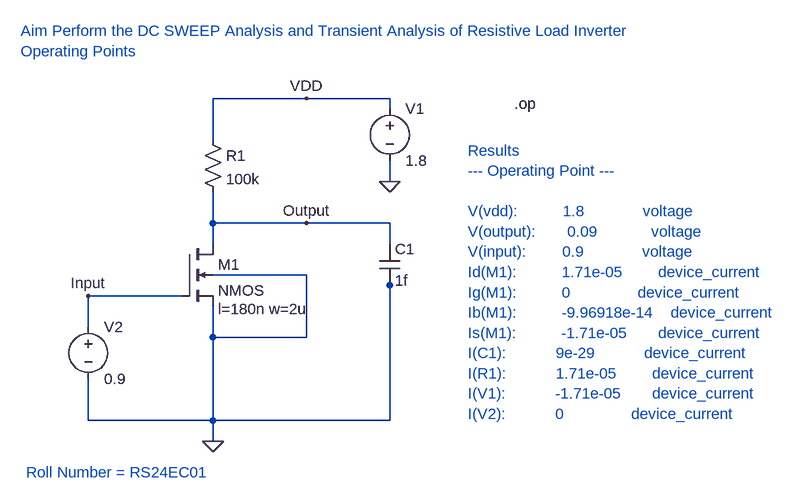
[diagram p0: schematic Exp1 VTC_Resistive_Inverter_Operating_Point.asc]
Exp1 VTC_Resistive_Inverter_Operating_Point.asc, the LTspice schematic file:
Version 4
SHEET 1 1576 680
WIRE 448 -112 304 -112
WIRE 576 -112 448 -112
WIRE 576 -96 576 -112
WIRE 304 -48 304 -112
WIRE 576 16 576 -16
WIRE 304 80 304 32
WIRE 448 80 304 80
WIRE 576 80 448 80
WIRE 304 112 304 80
WIRE 576 112 576 80
WIRE 448 160 304 160
WIRE 576 176 576 160
WIRE 256 192 112 192
WIRE 112 240 112 192
WIRE 304 256 304 208
WIRE 448 256 448 160
WIRE 448 256 304 256
WIRE 112 384 112 320
WIRE 304 384 304 256
WIRE 304 384 112 384
WIRE 576 384 576 176
WIRE 576 384 304 384
WIRE 304 416 304 384
FLAG 576 16 0
FLAG 304 416 0
FLAG 112 192 Input
FLAG 448 80 Output
FLAG 448 -112 VDD
SYMBOL res 288 -64 R0
SYMATTR InstName R1
SYMATTR Value 100k
SYMBOL cap 560 112 R0
SYMATTR InstName C1
SYMATTR Value 1f
SYMBOL voltage 576 -112 R0
WINDOW 123 0 0 Left 0
WINDOW 39 0 0 Left 0
SYMATTR InstName V1
SYMATTR Value 1.8
SYMBOL voltage 112 224 R0
WINDOW 123 0 0 Left 0
WINDOW 39 0 0 Left 0
SYMATTR InstName V2
SYMATTR Value 0.9
SYMBOL nmos4 256 112 R0
WINDOW 123 56 100 Left 2
SYMATTR Value2 l=180n w=2u
SYMATTR InstName M1
TEXT 8 -216 Left 2 ;Aim Perform the DC SWEEP Analysis and Transient Analysis of Resistive Load Inverter\nOperating Points
TEXT 16 464 Left 2 ;Roll Number = RS24EC01
TEXT 768 -104 Left 2 !.op
TEXT 696 -32 Left 2 ;Results \n--- Operating Point ---\n \nV(vdd):          1.8             voltage\nV(output):       0.09            voltage\nV(input):        0.9             voltage\nId(M1):          1.71e-05        device_current\nIg(M1):          0               device_current\nIb(M1):          -9.96918e-14    device_current\nIs(M1):          -1.71e-05       device_current\nI(C1):           9e-29           device_current\nI(R1):           1.71e-05        device_current\nI(V1):           -1.71e-05       device_current\nI(V2):           0               device_current

The netlist it stands for:
* Exp1 VTC_Resistive_Inverter_Operating_Point.asc
R1 VDD Output 100k
C1 Output 0 1f
V1 VDD 0 1.8
V2 Input 0 0.9
M1 Output Input 0 0 NMOS l=180n w=2u
.model NMOS NMOS
.model PMOS PMOS
.lib standard.mos
* Aim Perform the DC SWEEP Analysis and Transient Analysis of Resistive Load Inverter
* Operating Points
* Roll Number = RS24EC01
.op
* Results
* --- Operating Point ---
* V(vdd):          1.8             voltage
* V(output):       0.09            voltage
* V(input):        0.9             voltage
* Id(M1):          1.71e-05        device_current
* Ig(M1):          0               device_current
* Ib(M1):          -9.96918e-14    device_current
* Is(M1):          -1.71e-05       device_current
* I(C1):           9e-29           device_current
* I(R1):           1.71e-05        device_current
* I(V1):           -1.71e-05       device_current
* I(V2):           0               device_current
.backanno
.end